# EAGLE design ballistic-supply (EAGLE 7.5.0)
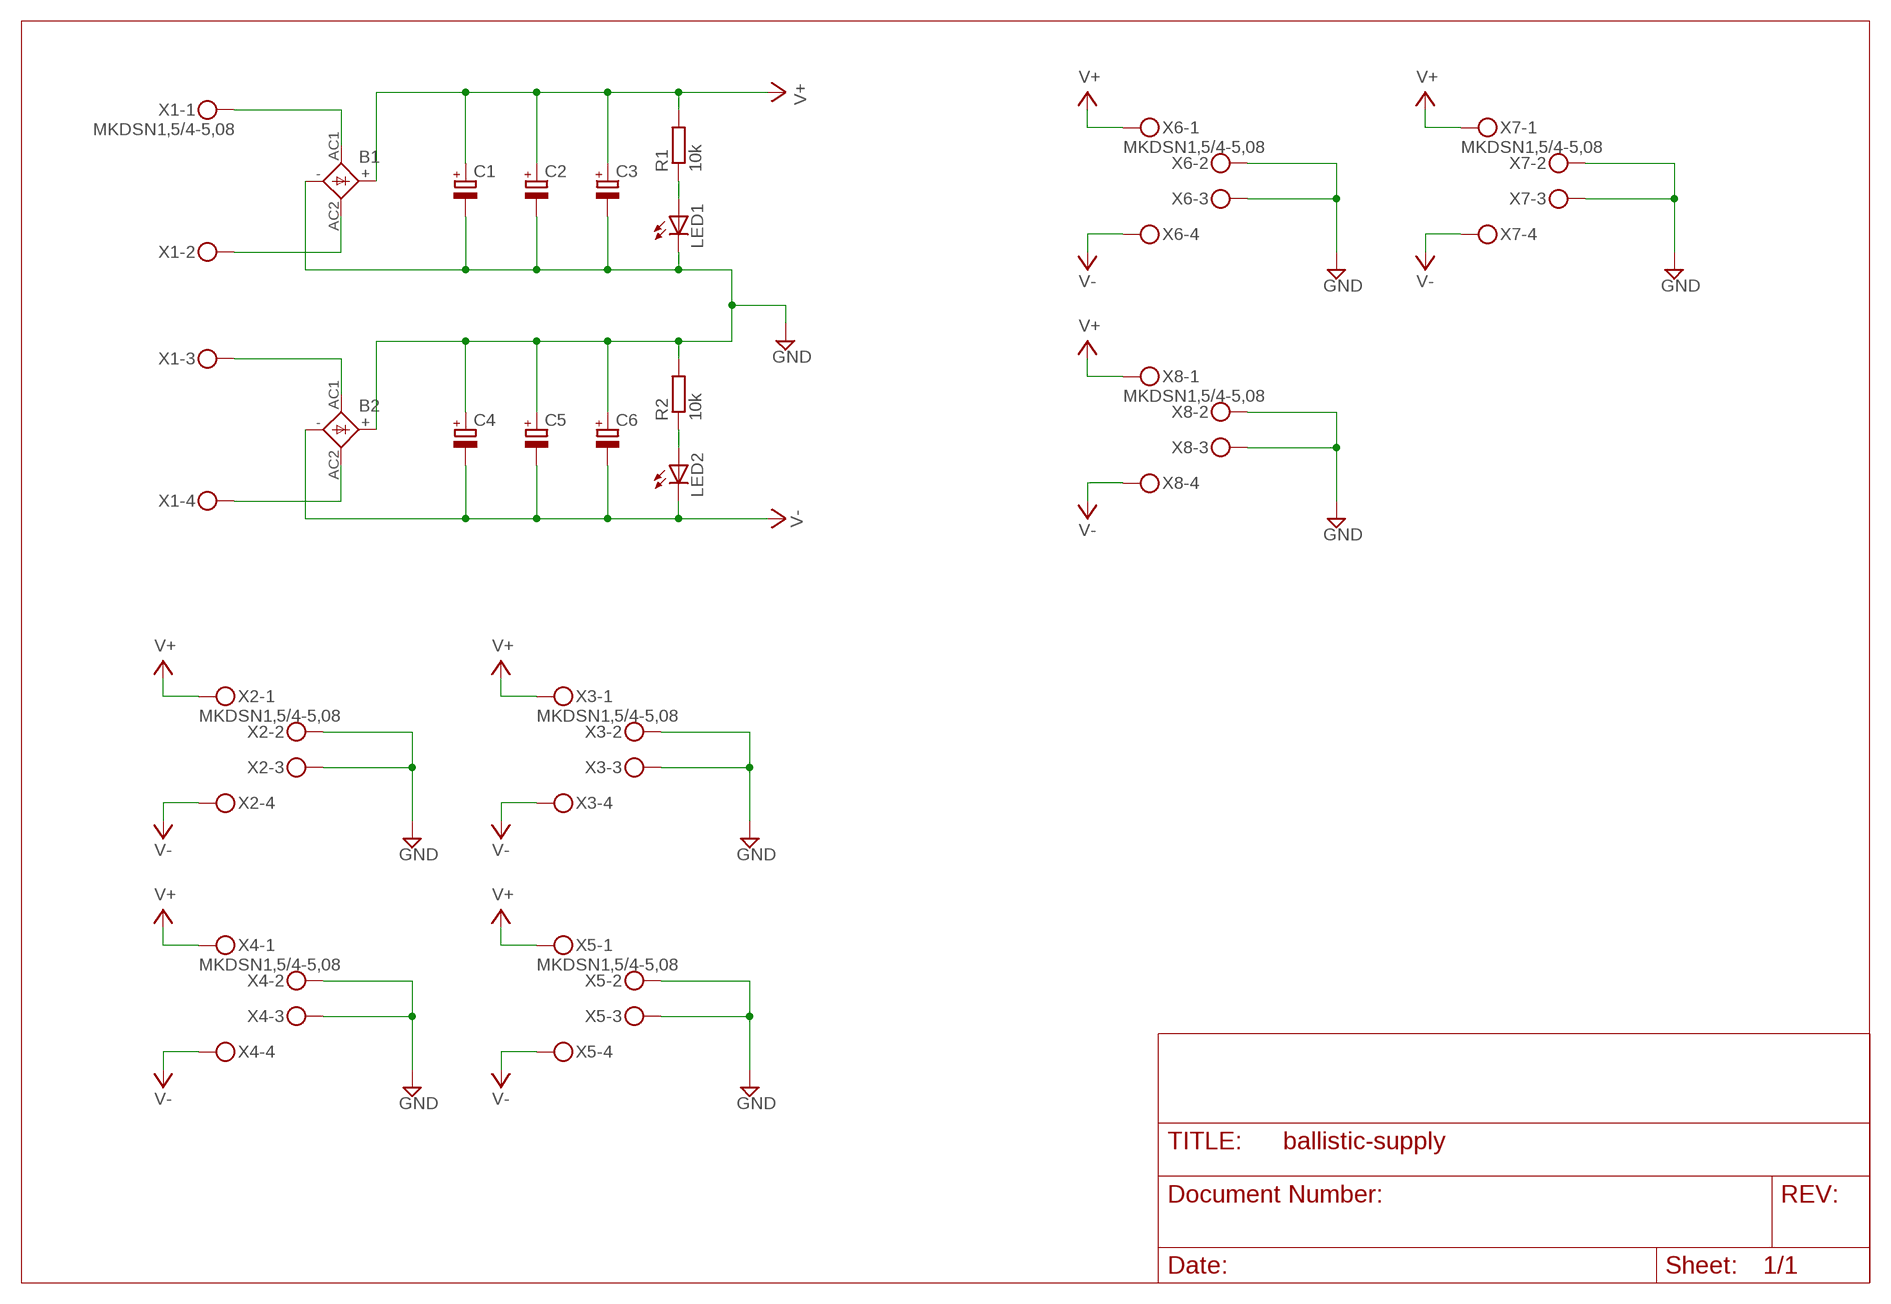
[diagram p0: schematic, sheet 1]

## Parts
B1  SKB32  [SKB32]
B2  SKB32  [SKB32]
C1  CPOL-EUE7.5-18  [E7,5-18]
C2  CPOL-EUE7.5-18  [E7,5-18]
C3  CPOL-EUE7.5-18  [E7,5-18]
C4  CPOL-EUE7.5-18  [E7,5-18]
C5  CPOL-EUE7.5-18  [E7,5-18]
C6  CPOL-EUE7.5-18  [E7,5-18]
LED1  LEDSMT1206  [1206]
LED2  LEDSMT1206  [1206]
R1  10k  R-EU_M1206  [M1206]
R2  10k  R-EU_M1206  [M1206]
X1  MKDSN1,5/4-5,08  [MKDSN1,5/4-5,08]
X2  MKDSN1,5/4-5,08  [MKDSN1,5/4-5,08]
X3  MKDSN1,5/4-5,08  [MKDSN1,5/4-5,08]
X4  MKDSN1,5/4-5,08  [MKDSN1,5/4-5,08]
X5  MKDSN1,5/4-5,08  [MKDSN1,5/4-5,08]
X6  MKDSN1,5/4-5,08  [MKDSN1,5/4-5,08]
X7  MKDSN1,5/4-5,08  [MKDSN1,5/4-5,08]
X8  MKDSN1,5/4-5,08  [MKDSN1,5/4-5,08]

## Nets
GND: B1.- B2.+ C1.- C2.- C3.- C4.+ C5.+ C6.+ LED1.C R2.2 X2.2 X2.3 X3.2 X3.3 X4.2 X4.3 X5.2 X5.3 X6.2 X6.3 X7.2 X7.3 X8.2 X8.3
N$1: B1.AC1 X1.1
N$2: B1.AC2 X1.2
N$5: B2.AC1 X1.3
N$6: B2.AC2 X1.4
N$7: LED2.A R2.1
N$9: LED1.A R1.1
V+: B1.+ C1.+ C2.+ C3.+ R1.2 X2.1 X3.1 X4.1 X5.1 X6.1 X7.1 X8.1
V-: B2.- C4.- C5.- C6.- LED2.C X2.4 X3.4 X4.4 X5.4 X6.4 X7.4 X8.4

## Library data of the parts
B1 B2 = rectifier:SKB32: SEMIKRON RECTIFIER
C1-C6 = rcl:CPOL-EU: POLARIZED CAPACITOR, European symbol
LED1 LED2 = led:LED: LED OSRAM: - CHIPLED LG R971, LG N971, LY N971, LG Q971, LY Q971, LO R971, LY R971 LH N974, LH R974 LS Q976, LO Q976, LY Q976 LO Q996 - Hyper CHIPLED LW Q18S LB Q993, LB Q99A, LB R99A - SideLED LS A670, LO A670, LY A670, LG A670, LP A670 LB A673, LV A673, LT A673, LW A673 LH A674 LY A675 LS A676, LA A676, LO A676, LY A676, LW A676 LS A679, LY A679, LG A679 - Hyper Micro SIDELED® LS Y876, LA Y876, LO Y876, LY Y876 LT Y87S - SmartLED LW L88C, LW L88S LB L89C, LB L89S, LG L890 LS L89K, LO L89K, LY L89K LS L896, LA L896, LO L896, LY L896 - TOPLED LS T670, LO T670, LY T670, LG T670, LP T670 LSG T670, LSP T670, LSY T670, LOP T670, LYG T670 LG T671, LOG T671, LSG T671 LB T673, LV T673, LT T673, LW T673 LH T674 LS T676, LA T676, LO T676, LY T676, LB T676, LH T676, LSB T676, LW T676 LB T67C, LV T67C, LT T67C, LS T67K, LO T67K, LY T67K, LW E67C LS E67B, LA E67B, LO E67B, LY E67B, LB E67C, LV E67C, LT E67C LW T67C LS T679, LY T679, LG T679 LS T770, LO T770, LY T770, LG T770, LP T770 LB T773, LV T773, LT T773, LW T773 LH T774 LS E675, LA E675, LY E675, LS T675 LS T776, LA T776, LO T776, LY T776, LB T776 LHGB T686 LT T68C, LB T68C - Hyper Mini TOPLED® LB M676 - Mini TOPLED Santana® LG M470 LS M47K, LO M47K, LY M47K Source: http://www.osram.convergy.de LUXEON: - LUMILED® LXK2-PW12-R00, LXK2-PW12-S00, LXK2-PW14-U00, LXK2-PW14-V00 LXK2-PM12-R00, LXK2-PM12-S00, LXK2-PM14-U00 LXK2-PE12-Q00, LXK2-PE12-R00, LXK2-PE12-S00, LXK2-PE14-T00, LXK2-PE14-U00 LXK2-PB12-K00, LXK2-PB12-L00, LXK2-PB12-M00, LXK2-PB14-N00, LXK2-PB14-P00, LXK2-PB14-Q00 LXK2-PR12-L00, LXK2-PR12-M00, LXK2-PR14-Q00, LXK2-PR14-R00 LXK2-PD12-Q00, LXK2-PD12-R00, LXK2-PD12-S00 LXK2-PH12-R00, LXK2-PH12-S00 LXK2-PL12-P00, LXK2-PL12-Q00, LXK2-PL12-R00 Source: www.luxeon.com KINGBRIGHT: KA-3528ASYC Source: www.kingbright.com
R1 R2 = rcl:R-EU_: RESISTOR, European symbol
X1-X8 = con-phoenix-508:MKDSN1,5/4-5,08: MKDSN 1,5/ 4-5,08 Printklemme Nennstrom: 13,5 A Nennspannung: 250 V Rastermaß: 5,08 mm Polzahl: 4 Anschlussart: Schraubanschluss Montage: Löten Anschlussrichtung Leiter/Platine: 0 ° Artikelnummer: 1729144 Source: http://eshop.phoenixcontact.com .. 1729144.pdf

## Board
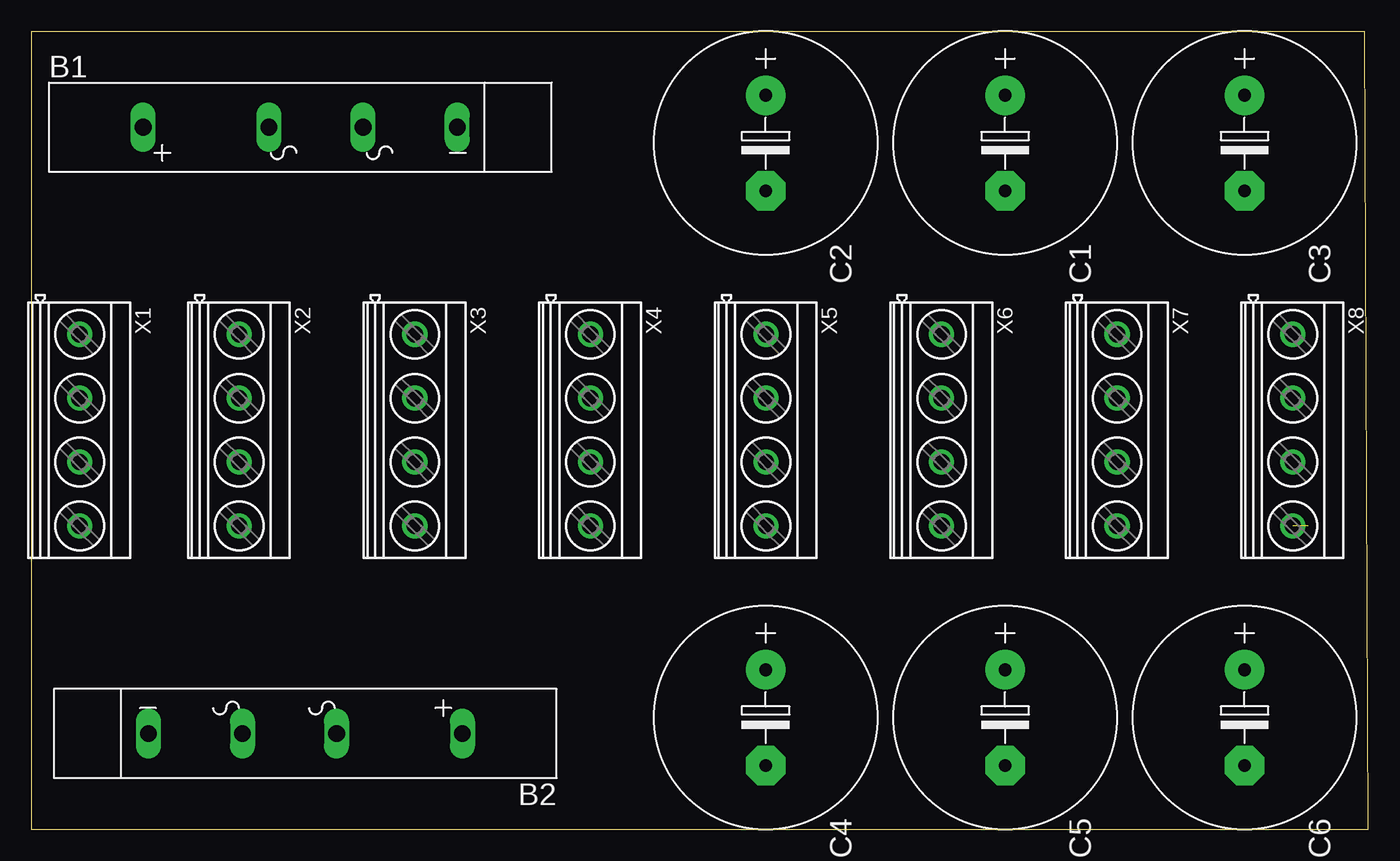
[diagram p1: board, top side]
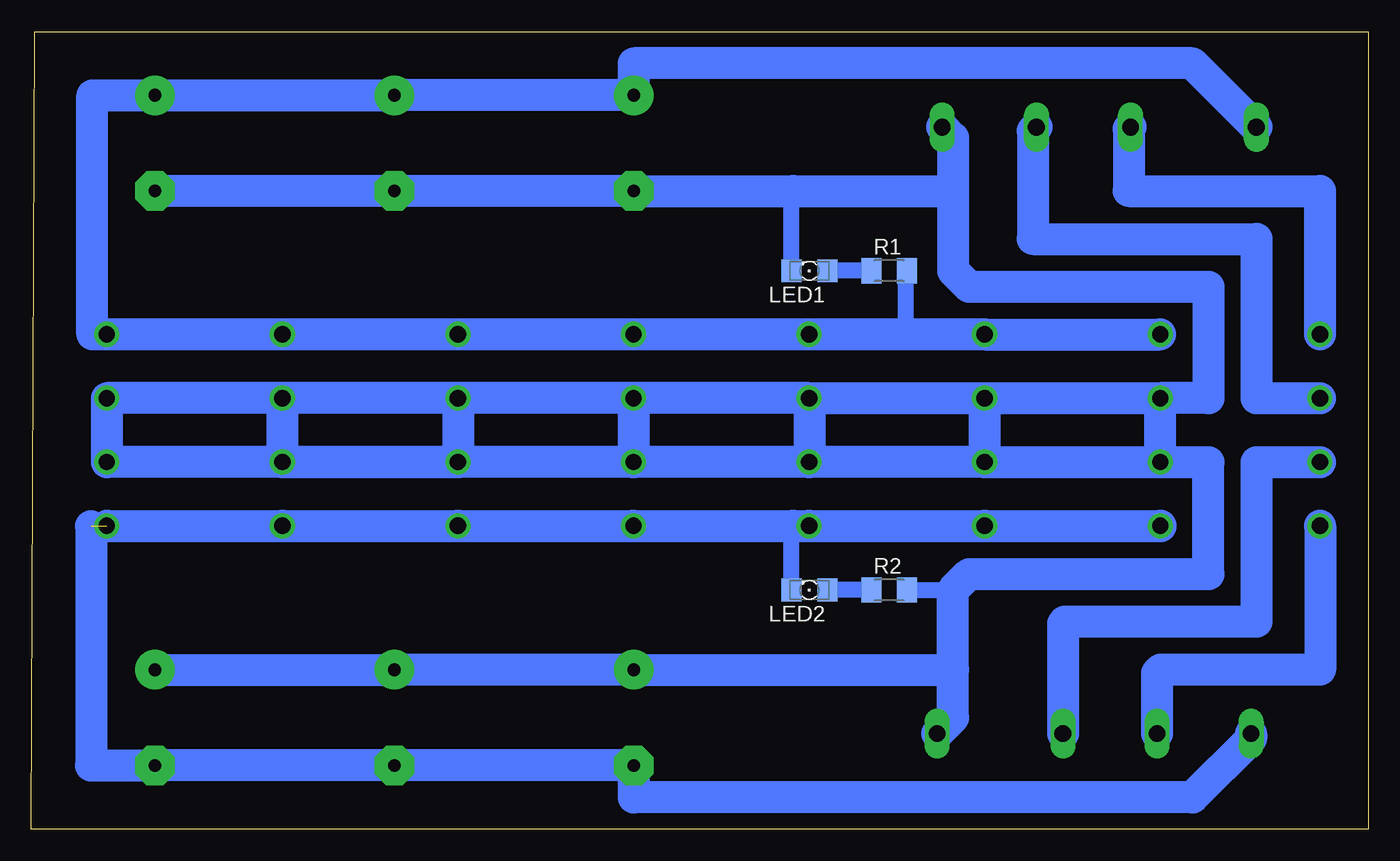
[diagram p2: board, bottom side, seen from below]

Size 106.35 x 63.49 mm. Coordinates in mm from the lower left corner, seen from the top.
Outline: 0,0 106.35,0 106.1,63.49 0,63.49 0,0
Copper layers (1*16): Top 0.035mm / dielectric 1.5mm / Bottom 0.035mm
Design rules "default *": minimum track width 100mil, minimum drill 24mil, track to track 8mil, track to pad 8mil, pad to pad 8mil, via to via 8mil, smd to smd 8mil, copper to edge 40mil, drill to drill 8mil, minimum pad ring 10mil, minimum via ring 8mil, stop-mask expansion 4mil, vias tented up to drill 0mil, thermal gap 10mil

### Footprints (pad centres in the part's own frame; a part is rotated, then mirrored left to right if it is on the bottom)
SKB32 = drill 1.321 long: + -13.97,0; - 11.024,0; AC1 -3.962,0; AC2 3.531,0
E7,5-18 = drill 1.016 pad 3.15: + -3.81,0 | drill 1.016 pad 3.15 octagon: - 3.81,0
1206 = smd 1.6 x 1.803: A -1.422,0; C 1.422,0
M1206 = smd 1.6 x 2: 1 -1.4,0; 2 1.4,0
MKDSN1,5/4-5,08 = drill 1.3 pad 2: 1 -7.641,0.025; 2 -2.561,0.025; 3 2.519,0.025; 4 7.599,0.025

### Placement (x,y rotation side)
B1  22.86,55.88 0 top
B2  20.32,7.62 180 top
C1  77.47,54.61 270 top
C2  58.42,54.61 270 top
C3  96.52,54.61 270 top
C4  58.42,8.89 270 top
C5  77.47,8.89 270 top
C6  96.52,8.89 270 top
LED1  44.45,44.45 180 bottom
LED2  44.45,19.05 180 bottom
R1  38.1,44.45 0 bottom
R2  38.1,19.05 0 bottom
X1  3.81,31.75 270 top
X2  16.51,31.75 270 top
X3  30.48,31.75 270 top
X4  44.45,31.75 270 top
X5  58.42,31.75 270 top
X6  72.39,31.75 270 top
X7  86.36,31.75 270 top
X8  100.33,31.75 270 top

### Tracks (layer width: path | path; a pad name or v marks a point on that pad's centre or on a via)
GND
  Bottom 1.27: R2.2 33.02,19.05 | LED1.C 45.87,50.65 45.72,50.8
  Bottom 2.54: X2.3 X2.2 | X3.3 X2.3 | X4.2 X5.2 X6.2 | X5.3 X6.3 X7.3 X8.3 | X6.2 X7.2 X8.2 X8.3 100.33,29.21 | X5.3 X4.3 X3.3 | X4.2 X3.2 X2.2 | X2.2 12.72,34.31 12.7,34.29 12.7,43.18 31.75,43.18 33.02,44.45 33.02,50.8 | B1.- 33.02,55.02 33.02,50.8 | C6.+ C5.+ C4.+ 33.02,12.7 | B2.+ 33.02,8.89 33.02,12.7 | 33.02,12.7 33.02,19.05 31.75,20.32 12.7,20.32 12.7,29.21 12.72,29.23 X2.3 | X5.3 58.42,29.21 58.42,33.02 | X4.2 44.45,34.29 44.45,29.21 | X3.3 30.5,34.27 30.48,34.29 | X6.2 X6.3 72.39,29.21 86.36,29.21 86.36,34.29 | C3.- C1.- C2.- 45.72,50.8 33.02,50.8
N$1
  Bottom 2.54: B1.AC1 19.05,55.73 19.05,50.8 3.81,50.8 3.83,50.77 X1.1
N$2
  Bottom 2.54: B1.AC2 26.67,55.6 26.67,46.99 8.89,46.99 8.89,34.29 8.87,34.31 X1.2
N$5
  Bottom 2.54: X1.3 3.86,29.21 8.89,29.21 8.89,16.51 24.13,16.51 24.28,16.36 B2.AC1
N$6
  Bottom 2.54: X1.4 3.81,24.13 3.81,12.7 16.51,12.7 16.79,12.42 B2.AC2
N$7
  Bottom 1.27: R2.1 LED2.A
N$9
  Bottom 1.27: 39.37,44.45 R1.1 LED1.A
V+
  Bottom 1.27: R1.2 36.83,44.45 36.83,39.39
  Bottom 2.54: X2.1 X3.1 36.83,39.39 X4.1 X5.1 X6.1 X7.1 X8.1 101.5,39.39 101.5,58.42 C3.+ C1.+ C2.+ 58.42,60.96 13.97,60.96 B1.+
V-  (1 unrouted)
  Bottom 1.27: LED2.C 45.87,24 45.72,24.15
  Bottom 2.54: X8.4 X7.4 X6.4 X5.4 45.72,24.15 X4.4 X3.4 X2.4 16.51,24.15 16.51,24.13 | B2.- 9.3,7.21 13.97,2.54 58.42,2.54 C4.- C5.- C6.- 101.6,5.08 101.6,24.13